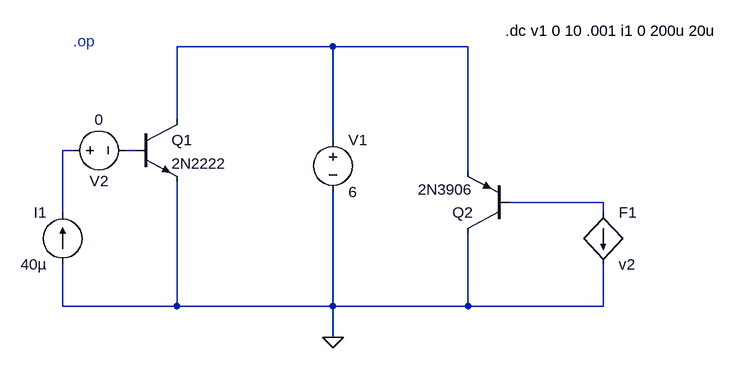
[diagram p0: schematic pnp2n2222.asc]
pnp2n2222.asc, the LTspice schematic file:
Version 4
SHEET 1 1392 984
WIRE -432 208 -672 208
WIRE -224 208 -432 208
WIRE -672 320 -672 208
WIRE -432 352 -432 208
WIRE -832 368 -848 368
WIRE -736 368 -752 368
WIRE -224 400 -224 208
WIRE -16 448 -160 448
WIRE -848 464 -848 368
WIRE -16 464 -16 448
WIRE -848 608 -848 544
WIRE -672 608 -672 416
WIRE -672 608 -848 608
WIRE -432 608 -432 432
WIRE -432 608 -672 608
WIRE -224 608 -224 496
WIRE -224 608 -432 608
WIRE -16 608 -16 544
WIRE -16 608 -224 608
WIRE -432 656 -432 608
FLAG -432 656 0
SYMBOL voltage -432 336 R0
WINDOW 123 0 0 Left 0
WINDOW 39 0 0 Left 0
SYMATTR InstName V1
SYMATTR Value 6
SYMBOL current -848 544 R180
WINDOW 0 24 80 Left 2
WINDOW 3 24 0 Left 2
WINDOW 123 0 0 Left 0
WINDOW 39 0 0 Left 0
SYMATTR InstName I1
SYMATTR Value 40µ
SYMBOL voltage -848 368 R270
WINDOW 0 -32 56 VBottom 2
WINDOW 3 32 56 VTop 2
WINDOW 123 0 0 Left 0
WINDOW 39 0 0 Left 0
SYMATTR InstName V2
SYMATTR Value 0
SYMBOL npn -736 320 R0
SYMATTR InstName Q1
SYMATTR Value 2N2222
SYMBOL pnp -160 496 R180
SYMATTR InstName Q2
SYMATTR Value 2N3906
SYMBOL f -16 464 R0
SYMATTR InstName F1
SYMATTR Value v2
SYMATTR Value2 1
TEXT 160 184 Right 2 !.dc v1 0 10 .001 i1 0 200u 20u
TEXT -832 200 Left 2 ;.op

The netlist it stands for:
* pnp2n2222.asc
V1 N001 0 6
I1 0 N002 40µ
V2 N002 N003 0
Q1 N001 N003 0 0 2N2222
Q2 0 N004 N001 0 2N3906
F1 N004 0 v2 1
.model NPN NPN
.model PNP PNP
.lib standard.bjt
.dc v1 0 10 .001 i1 0 200u 20u
* .op
.backanno
.end